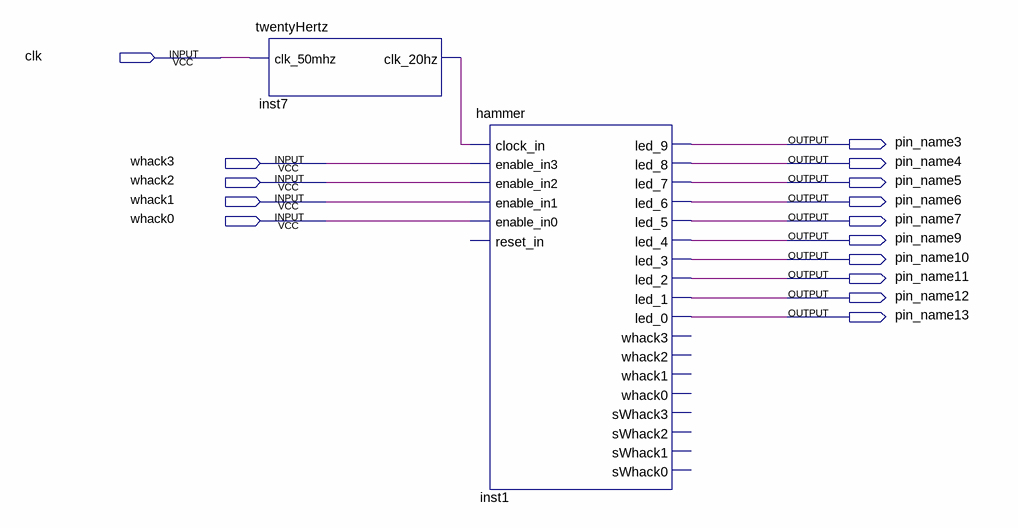
[diagram p0: schematic sheet]
// Quartus schematic whack_test.bdf as structural Verilog: 2 symbols, 15 pins
module whack_test (
  input  clk,
  input  whack3,
  input  whack2,
  input  whack1,
  input  whack0,
  output pin_name3,
  output pin_name4,
  output pin_name5,
  output pin_name6,
  output pin_name7,
  output pin_name9,
  output pin_name10,
  output pin_name11,
  output pin_name12,
  output pin_name13
);

  wire inst7_clk_20hz;

  twentyHertz inst7 (.clk_50mhz(clk), .clk_20hz(inst7_clk_20hz));
  hammer inst1 (
    .clock_in(inst7_clk_20hz), .enable_in3(whack3), .enable_in2(whack2), .enable_in1(whack1),
    .enable_in0(whack0), .led_9(pin_name3), .led_8(pin_name4), .led_7(pin_name5), .led_6(pin_name6),
    .led_5(pin_name7), .led_4(pin_name9), .led_3(pin_name10), .led_2(pin_name11), .led_1(pin_name12),
    .led_0(pin_name13));  // open: reset_in, whack3, whack2, whack1, whack0, sWhack3, sWhack2, sWhack1, sWhack0
endmodule
